# Altium schematic sheet schematic.SchDoc
size A3
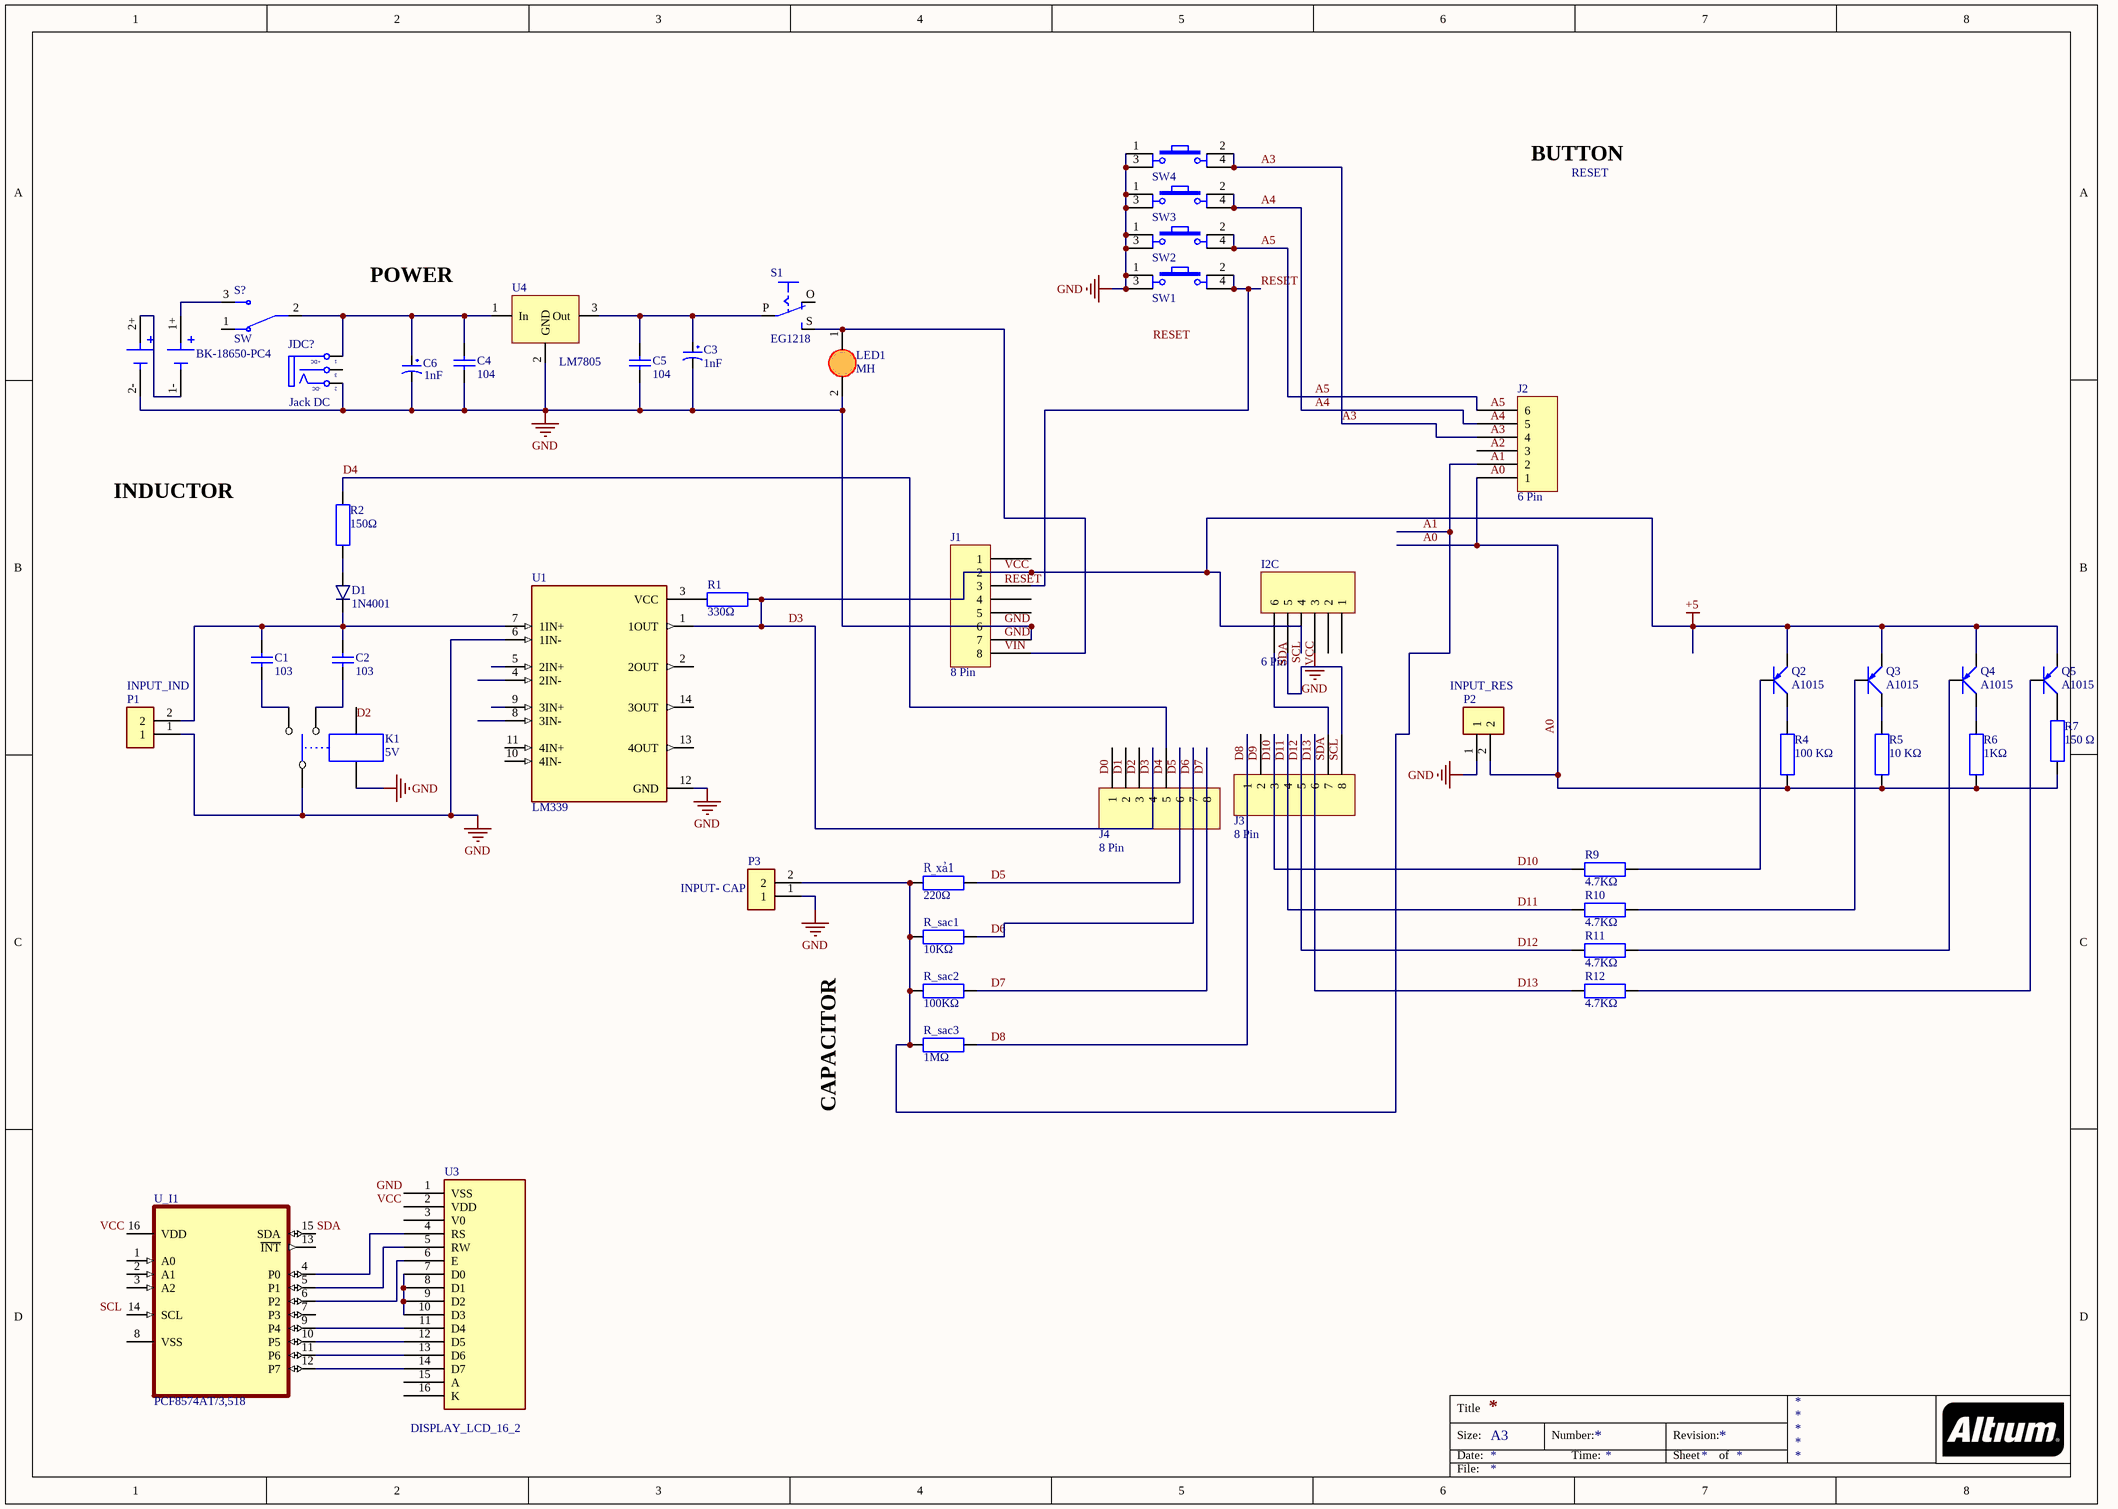
[diagram p0: schematic.SchDoc]

## Parts
?  BK-18650-PC4  [BAT_BK-18650-PC4]
C1  103  [tu gom]
C2  103  [tu gom]
C3  1nF  [tu hoa 6.5mm]
C4  104  [tu gom]
C5  104  [tu gom]
C6  1nF  [tu hoa 6.5mm]
D1  1N4001  [1N4007]
I2C  6 Pin  [SAMTEC SSW-106-03-T-S]
J1  8 Pin  [SAMTEC SSW-108-03-T-S]
J2  6 Pin  [SAMTEC SSW-106-03-T-S]
J3  8 Pin  [SAMTEC SSW-108-03-T-S]
J4  8 Pin  [SAMTEC SSW-108-03-T-S]
JDC?  Jack DC  [DC-IN]
K1  5V  [RELAY5PIN-10A]
LED1  MH  [LED5MM]
P1  INPUT_IND  [TE_282837-2]
P2  INPUT_RES  [TE_282837-2]
P3  INPUT- CAP  [TE_282837-2]
Q2  A1015  [QTO-92]
Q3  A1015  [QTO-92]
Q4  A1015  [QTO-92]
Q5  A1015  [QTO-92]
R1  330Ω  [DIEN TRO 2W]
R2  150Ω  [DIEN TRO 2W]
R4  100 KΩ  [Tro Vach 1/4W]
R5  10 KΩ  [Tro Vach 1/4W]
R6  1KΩ  [Tro Vach 1/4W]
R7  150 Ω  [Tro Vach 1/4W]
R9  4.7KΩ  [Tro Vach 1/4W]
R10  4.7KΩ  [Tro Vach 1/4W]
R11  4.7KΩ  [Tro Vach 1/4W]
R12  4.7KΩ  [Tro Vach 1/4W]
R_sac1  10KΩ  [Tro Vach 1/4W]
R_sac2  100KΩ  [Tro Vach 1/4W]
R_sac3  1MΩ  [Tro Vach 1/4W]
R_xả1  220Ω  [Tro Vach 1/4W]
S1  EG1218  [EG1218]
S?  SW  [SW_MINI-SPDT-SW]
SW1  Nut Nhan 4 Chan  [SW4]  (value not drawn)
SW2  Nut Nhan 4 Chan  [SW4]  (value not drawn)
SW3  Nut Nhan 4 Chan  [SW4]  (value not drawn)
SW4  Nut Nhan 4 Chan  [SW4]  (value not drawn)
U1  LM339  [DIP794W45P254L1969H508Q14]
U3  DISPLAY_LCD_16_2  [DISPLAY_LCD_16_2]
U4  LM7805  [TO254P1054X470X2600-3]
U_I1  PCF8574AT/3,518  [SOIC127P1032X265-16N]

## Nets
D3: I2C.4 J1.2 J4.4 Q2.3(E) Q3.3(E) Q4.3(E) Q5.3(E) R1.2 U1.1(1OUT)  [also labelled +5, VCC]
GND: ?.2- C3.2 C4.2 C5.2 C6.2 I2C.3 J1.6 J1.7 JDC?.2(TN) K1.1 K1.5 LED1.2(K) P1.1 P2.1 P3.1 SW1.1 SW1.3 SW2.1 SW2.3 SW3.1 SW3.3 SW4.1 SW4.3 U1.6(1IN-) U1.12(GND) U4.2(GND)
A0: J2.1 P2.2 R4.1 R5.1 R6.1 R7.1
A1: J2.2 P3.2 R_sac1.1 R_sac2.1 R_sac3.1 R_xả1.1
A3: J2.4 SW4.2 SW4.4
A4: J2.5 SW3.2 SW3.4
A5: J2.6 SW2.2 SW2.4
D4: J4.5 R2.2
D5: J4.6 R_xả1.2
D6: J4.7 R_sac1.2
D7: J4.8 R_sac2.2
D8: J3.1 R_sac3.2
D10: J3.3 R9.1
D11: J3.4 R10.1
D12: J3.5 R11.1
D13: J3.6 R12.1
RESET: J1.3 SW1.2 SW1.4
SDA: I2C.6 J3.7
Net?_1+: ?.1+ S?.3
Net?_1-: ?.1- ?.2+
NetC1_1: C1.1 C2.1 D1.2 P1.2 U1.7(1IN+)
NetC1_2: C1.2 K1.3
NetC2_2: C2.2 K1.2
NetC3_1: C3.1 C5.1 S1.P U4.3(Out)
NetC4_1: C4.1 C6.1 JDC?.1(T) S?.2 U4.1(In)
NetD1_1: D1.1 R2.1
NetI2C_5: I2C.5 J3.8
NetJ1_8: J1.8 LED1.1(A) S1.S
NetQ2_1: Q2.1(B) R9.2
NetQ2_2: Q2.2(C) R4.2
NetQ3_1: Q3.1(B) R10.2
NetQ3_2: Q3.2(C) R5.2
NetQ4_1: Q4.1(B) R11.2
NetQ4_2: Q4.2(C) R6.2
NetQ5_1: Q5.1(B) R12.2
NetQ5_2: Q5.2(C) R7.2
NetR1_1: R1.1 U1.3(VCC)
NetU3_4: U3.4(RS) U_I1.4(P0)
NetU3_5: U3.5(RW) U_I1.5(P1)
NetU3_6: U3.6(E) U_I1.6(P2)
NetU3_7: U3.7(D0) U3.8(D1) U3.9(D2) U3.10(D3)
NetU3_11: U3.11(D4) U_I1.9(P4)
NetU3_12: U3.12(D5) U_I1.10(P5)
NetU3_13: U3.13(D6) U_I1.11(P6)
NetU3_14: U3.14(D7) U_I1.12(P7)

Not connected (* = marked no-connect by the designer): I2C 1 2; J1 1 4 5; J2 3; J3 2; J4 1 2 3; JDC? 3(S); K1 4; S1 O; S? 1; U1 2(2OUT) 4(2IN-) 5(2IN+) 8(3IN-) 9(3IN+) 10(4IN-) 11(4IN+) 13(4OUT) 14(3OUT); U3 1(VSS) 2(VDD) 3(V0) 15(A) 16(K); U_I1 1(A0) 2(A1) 3(A2) 7(P3) 8(VSS) 13(~{INT}) 14(SCL) 15(SDA) 16(VDD)

## Notes on the sheet
- BUTTON
- RESET
- POWER
- INDUCTOR
- CAPACITOR
- Labels drawn without touching a wire or pin: A0, A1, A2, A3, A4, A5, D0, D1, D2, D4, D9, GND, RESET, SCL, SDA, VCC, VIN
- Title
- Size:
- Date:
- A3
- Number:
- Time:
- Revision:
- Sheet
- of
- File:
- (in symbol Jac_DC) +DC; -DC

## Library data of the parts
? = BK-18650-PC4: Battery Holder (Open) 18650 2 Cell PC Pin; Price: None; Value: *; Package: None; Availability: Unavailable; MP: BK-18650-PC4
C1 C2 C4 C5 = Tu gom 103 50V: Cắm; So_Chan: 2; Ten_Linh_Kien: Tụ gốm 103 10nF 50V; Don_Vi: Con; Ma_Hang: MH000936; Chung_Loai: Cắm; Kieu_Chan: *
C3 C6 = Tu Hoa 100uF 35V 6x8: Cắm; Don_Vi: Con; So_Chan: 2; Ten_Linh_Kien: Tụ Hóa 100uF 35V; Ma_Hang: MH006862; Chung_Loai: Cắm; Kieu_Chan: *
D1 = 1N4007: Rectifier Diode 1000V 1A DO-41; Mouser PN: 637-1N4007; ComponentLink1Description: Datasheet; ComponentLink1URL: https://www.mouser.com/datasheet/2/849/1n4001-2577232.pdf; Digikey PN: 4617-1N4007TB-ND; JLCPCB PN: C3033995
JDC? = Jac_DC: Cắm; Ten_Linh_Kien: Jack DC5.5x2.1MM DC5501; Ma_Hang: MH000923; Don_Vi: Con; Kieu_Chan: *; Ghi_Chu: *; Chung_Loai: Cắm
K1 = RELAY-SPDT: Cắm; Ten_Linh_Kien: Relay 5V10A 5 Chân SRD-05VDC-SL-C; Don_Vi: Con; Ma_Hang: MH001007; Kieu_Chan: *; Ghi _Chu: *; Chung_Loai: Cắm
LED1 = LED 5mm: Cắm; Don_Vi: Con; Ten_Linh_Kien: *; Ghi_Chu: *; Kieu_Chan: *; Ma_Hang: *; Chung_Loai: Con
P1-P3 = 282837-2: Ð Ð°Ð·ÑŠÐµÐ¼Ð½Ñ‹Ðµ ÐºÐ»ÐµÐ¼Ð¼Ð½Ñ‹Ðµ ÐºÐ¾Ð»Ð¾Ð´ÐºÐ¸ Ð Ð¾Ð·ÐµÑ‚ÐºÐ° 2 Ð¿Ð¾Ð»Ð¾Ð¶ÐµÐ½Ð¸Ñ 5,08 Ð¼Ð¼ ÐŸÑ€Ð¸Ð¿Ð¾Ð¹ Ð¿Ñ€ÑÐ¼Ð¾Ð¹ Ñ‡ÐµÑ€ÐµÐ· Ð¾Ñ‚Ð²ÐµÑ€ÑÑ‚Ð¸Ðµ 13,5 Ð / ÐºÐ¾Ð½Ñ‚Ð°ÐºÑ‚; MF: TE Connectivity; SnapEDA_Link: https://www.snapeda.com/parts/282837-2/TE+Connectivity+AMP+Connectors/view-part/?ref=snap; Price: None; Check_prices: https://www.snapeda.com/parts/282837-2/TE+Connectivity+AMP+Connectors/view-part/?ref=eda; Purchase-URL: https://pricing.snapeda.com/search/part/282837-2/?ref=eda; MP: 282837-2; Value: *; Availability: In Stock; Package: None
Q2-Q5 = A1015: Dán; Ten_Linh_Kien: A1015 SOT23 TRANS PNP 0.15A 50V ( SMD-BA); Don_Vi: Con; Ma_Hang: MH001957; Ghi_Chu: *; Kieu_Chan: *; Chung_Loai: Dán
R1 R2 R4-R7 R9-R12 R_sac1-R_sac3 R_xả1 = Res 2W: Cắm; Ten_Linh_Kien: 2W; Ma_Hang: MH; Don_Vi: Con; Ghi _Chu: *; Kieu_Chan: *; Chung_Loai: Cắm
S1 = EG1218: Slide Switch SPDT Through Hole; MF: E-Switch; Purchase-URL: https://pricing.snapeda.com/search/part/EG1218/?ref=eda; Package: None; Availability: In Stock; MP: EG1218; Value: *; Check_prices: https://www.snapeda.com/parts/EG1218/E-Switch/view-part/?ref=eda; SnapEDA_Link: https://www.snapeda.com/parts/EG1218/E-Switch/view-part/?ref=snap; Price: None
S? = MINI-SPDT-SW: Simple breadboard friendly SPDT slide switch. Rated at 30V/200mA with operating force of 250 +/-100gf.; Availability: Unavailable; Package: None; MP: MINI-SPDT-SW; Value: *; Price: None
SW1-SW4 = Nut Nhan 4 Chan: Cắm; Value: Nút Nhấn 4 Chân 6x6x9MM DIP; Ma_Hang: MH004077; Don_Vi: Con; Kieu Chan: *; Ghi Chu: *
U1 = LM339: Comparator Differential CMOS, MOS, Open-Collector, TTL 14-SOIC; MF: Texas Instruments; Package: SOIC-14 Texas Instruments; Value: *; Price: None; MP: LM339; Availability: Unavailable; SnapEDA_Link: https://www.snapeda.com/parts/LM339/Texas%20Instruments/view-part/2886154/?ref=snap
U3 = DISPLAY_LCD_16_2: Display LCD 16x2 I2C.
U4 = LM7805: IC REG LIN 5V 1A
U_I1 = PCF8574AT/3,518: I/O Expander 8 IÂ²C 100kHz 16-SO; MF: NXP USA; DigiKey-Purchase-URL: https://snapeda.com/shop?store=DigiKey&id=1043241; Package: SOIC-16 NXP Semiconductors; Value: *; MP: PCF8574AT/3,518; Availability: Unavailable; Price: None; SnapEDA_Link: https://www.snapeda.com/parts/PCF8574AT/3,518/NXP%20USA%20Inc./view-part/1043241/?ref=snap